# Altium schematic sheet Audio.SchDoc
size A3; SheetNumber: 8; SheetTotal: 9
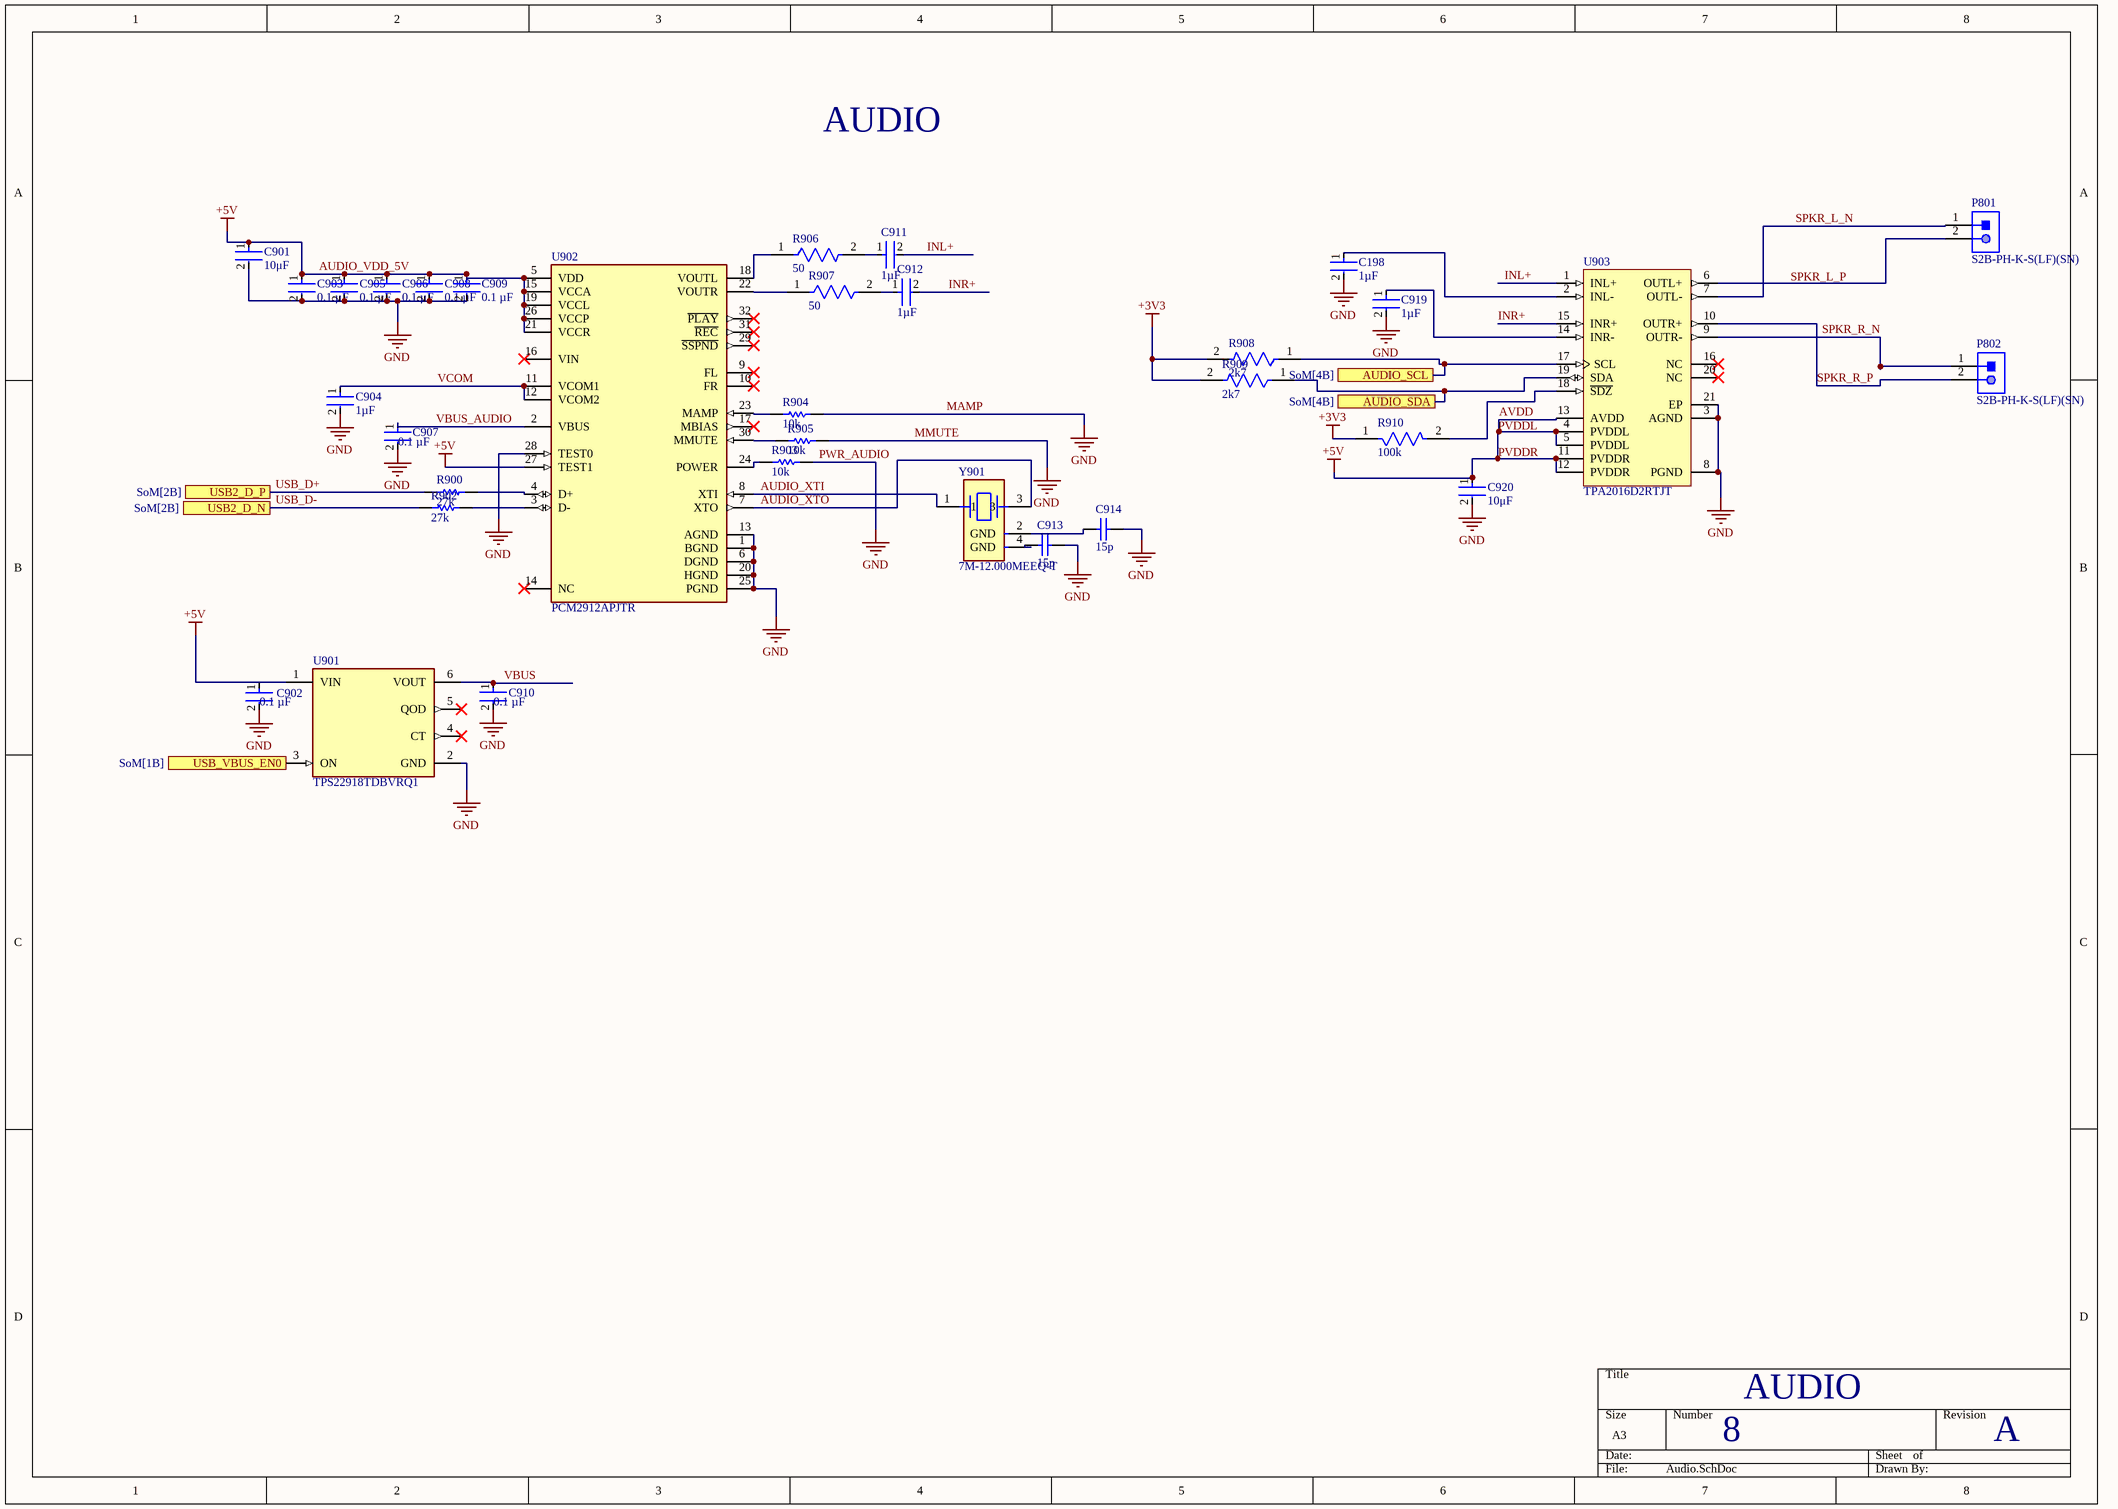
[diagram p0: Audio.SchDoc]

## Parts
C198  1µF  [FP-GRM15-0_1-MFG]
C901  10μF  [FP-GRM31C-0_2-e0_3_0_8-MFG]
C902  0.1 µF  [FP-GRM155-0_05-IPC_B]
C903  0.1 µF  [FP-GRM155-0_05-IPC_B]
C904  1µF  [FP-GRM15-0_1-MFG]
C905  0.1 µF  [FP-GRM155-0_05-IPC_B]
C906  0.1 µF  [FP-GRM155-0_05-IPC_B]
C907  0.1 µF  [FP-GRM155-0_05-IPC_B]
C908  0.1 µF  [FP-GRM155-0_05-IPC_B]
C909  0.1 µF  [FP-GRM155-0_05-IPC_B]
C910  0.1 µF  [FP-GRM155-0_05-IPC_B]
C911  1µF  [FP-GRM15-0_1-MFG]
C912  1µF  [FP-GRM15-0_1-MFG]
C913  15p  [CAPC1005X55X25LL05T10]
C914  15p  [CAPC1005X55X25LL05T10]
C919  1µF  [FP-GRM15-0_1-MFG]
C920  10μF  [FP-GRM31C-0_2-e0_3_0_8-MFG]
P801  S2B-PH-K-S(LF)(SN)  [JST-S2B-PH-K-S_V]
P802  S2B-PH-K-S(LF)(SN)  [JST-S2B-PH-K-S_V]
R900  27k  [RESC1005X40X25LL05T10]
R902  27k  [RESC1005X40X25LL05T10]
R903  10k  [RESC1005X40X25LL05T10]
R904  10k  [RESC1005X40X25LL05T10]
R905  10k  [RESC1005X40X25LL05T10]
R906  50  [FP-CRCW0603-e3-MFG]
R907  50  [FP-CRCW0603-e3-MFG]
R908  2k7  [FP-CR0402-IPC_B]
R909  2k7  [FP-CR0402-IPC_B]
R910  100k  [FP-RC0402-0_4-IPC_A]
U901  TPS22918TDBVRQ1  [FP-DBV0006A-IPC_C]
U902  PCM2912APJTR  [FP-PJT0032A-IPC_C]
U903  TPA2016D2RTJT  [RTJ0020D_V]
Y901  7M-12.000MEEQ-T  [FP-7M-MFG]

## Ports
AUDIO_SCL (see SoM[4B]), AUDIO_SDA (see SoM[4B]), USB2_D_N (see SoM[2B]), USB2_D_P (see SoM[2B]), USB_VBUS_EN0 (see SoM[1B])

## Nets
+3V3: R908.2 R909.2 R910.1
AUDIO_VDD_5V: C901.1 C903.1 C905.1 C906.1 C908.1 C909.1 C920.1 U901.1(VIN) U902.5(VDD) U902.15(VCCA) U902.19(VCCL) U902.21(VCCR) U902.26(VCCP) U902.27(TEST1) U903.4(PVDDL) U903.5(PVDDL) U903.11(PVDDR) U903.12(PVDDR) U903.13(AVDD)  [also labelled +5V, AVDD, PVDDL, PVDDR]
MAMP: C198.2 C901.2 C902.2 C903.2 C904.2 C905.2 C906.2 C907.2 C908.2 C909.2 C910.2 C913.1 C914.1 C919.2 C920.2 R903.1 R904.1 R905.1 U901.2(GND) U902.1(BGND) U902.6(DGND) U902.13(AGND) U902.20(HGND) U902.25(PGND) U902.28(TEST0) U903.3(AGND) U903.8(PGND) U903.21(EP)  [also labelled GND, MMUTE, PWR_AUDIO]
AUDIO_SCL: R908.1 U903.17(SCL) ; port AUDIO_SCL
AUDIO_SDA: R909.1 U903.19(SDA) ; port AUDIO_SDA
AUDIO_XTI: U902.8(XTI) Y901.1
AUDIO_XTO: U902.7(XTO) Y901.3
INL+: C911.2 U903.1(INL+)
INR+: C912.2 U903.15(INR+)
SPKR_L_N: P801.1 U903.7(OUTL-)
SPKR_R_N: P802.1 U903.9(OUTR-)
SPKR_R_P: P802.2 U903.10(OUTR+)
USB_D+: R900.1 ; port USB2_D_P
USB_D-: R902.1 ; port USB2_D_N
USB_VBUS_EN0: U901.3(ON) ; port USB_VBUS_EN0
VBUS: C910.1 U901.6(VOUT)
VBUS_AUDIO: C907.1 U902.2(VBUS)
VCOM: C904.1 U902.11(VCOM1) U902.12(VCOM2)
NetC198_1: C198.1 U903.2(INL-)
NetC911_1: C911.1 R906.2
NetC912_1: C912.1 R907.2
NetC913_2: C913.2 Y901.4(GND)
NetC914_2: C914.2 Y901.2(GND)
NetC919_1: C919.1 U903.14(INR-)
NetP801_2: P801.2 U903.6(OUTL+)
NetR900_2: R900.2 U902.4(D+)
NetR902_2: R902.2 U902.3(D-)
NetR903_2: R903.2 U902.24(POWER)
NetR904_2: R904.2 U902.23(MAMP)
NetR905_2: R905.2 U902.30(MMUTE)
NetR906_1: R906.1 U902.18(VOUTL)
NetR907_1: R907.1 U902.22(VOUTR)
NetR910_2: R910.2 U903.18(~{SDZ})

Not connected (* = marked no-connect by the designer): C902 1; U901 4(CT)* 5(QOD)*; U902 9(FL)* 10(FR)* 14(NC)* 16(VIN)* 17(MBIAS)* 29(~{SSPND})* 31(~{REC})* 32(~{PLAY})*; U903 16(NC)* 20(NC)*

## Notes on the sheet
- AUDIO
- 8
- A
- Labels drawn without touching a wire or pin: SPKR_L_P

## Library data of the parts
C198 C904 C911 C912 C919 = CMP-2008-04556-2: CAP CER 1UF 10V X5R 0402; Manufacturer Part Number: GRM155R61A105KE15D; Manufacturer: Murata; Material: Ceramic; Tolerance: 10%; Temperature Coefficient: 15%; Octopart: https://octopart.com/grm155r61a105ke15d-murata-197442; Lead Free: Yes; ComponentLink2Description: Datasheet; Temperature: -55°C to +85°C; Temperature Range High: +85°C; Height: 0.55mm; Capacitance: 1uF; Ipc Land Pattern Name: CAPC10050X50; ComponentLink2URL: https://search.murata.co.jp/Ceramy/image/img/A01X/G101/ENG/GRM155R61A105KE15-01A.pdf; Temperature Range Low: -55°C; Device Class L2: Capacitors; Voltage Rating: 10V; RoHS: TRUE; Device Class L1: Passive Components; Device Class L3: Ceramic Capacitors; Temperature Characteristic: X5R; Mouser Description: 0402 1 uF 10 V ±10% Tolerance X5R Surface Mount Multilayer Ceramic Capacitor; Automotive: No; Package: GRM15-0.1; Digikey Description: CAP CER 1UF 10V X5R 0402; Value: 1uF; Category: Cap
C901 C920 = CMP-06035-005515-1: Chip Multilayer Ceramic Capacitors for General Purpose, 1206, 10uF, X7R, 15%, 10%, 25V; Dielectric: X7R; Max Operating Temperature: 125°C; Capacitance: 10uF; Voltage Rating (DC): 25V; Case/Package: 1206; Thickness: 0.071inch; Tolerance: 10%; Voltage Rating: 25V; Mount: Surface Mount; Width: 0.063inch; Length: 0.126inch; Min Operating Temperature: -55°C; Packaging: Tape and Reel; Lead Free: Lead Free; Voltage: 25V
C902 C903 C905-C910 = CMP-06035-003750-1: Chip Multilayer Ceramic Capacitors for General Purpose, 0402, 0.10uF, X7R, 15%, 10%, 50V; Capacitance: 100nF; Weight: 0.000212oz; Package Quantity: 50000; Resistor Type: Ceramic; Mount: Surface Mount; Width: 0.5mm; Case Code (Imperial): 0402; Termination: SMD/SMT; Case/Package: 0402; Voltage Rating: 50V; Height: 0.5mm; Length: 0.039inch; Dielectric: X7R; Case Code (Metric): 1005; Min Operating Temperature: -55°C; Thickness: 0.022inch; Tolerance: 10%; Lead Free: Lead Free; Packaging: Tape and Reel; Max Operating Temperature: 125°C; Voltage Rating (DC): 50V
C913 C914 = CMP-2008-04266-1: Manufacturer: Murata; Part Number: GRM1555C1H150JA01D
P801 P802 = CMP-1755-00004-1: Male Header, Pitch 2 mm, 1 x 2 Position, Height 4.8 mm, Tail Length 3.4 mm, -25 to 85 degC, RoHS, Bulk; Case\Package: Radial; Tolerance: 20%; Capacitance: 10 uF; Voltage Rating (DC): 50 V; Packaging: Bulk; ComponentLink1URL: http://www.jst-mfg.com/product/pdf/eng/ePH.pdf; Radiation Hardening: No; Height: 11 mm; Package Quantity: 200; PackageDescription: Male Header, Pitch 2 mm, 1 x 2 Position, Height 4.8 mm, Tail Length 3.4 mm; PackageReference: S2B-PH-K-S; Diameter: 5 mm; Pins: 2; Mount: Through Hole; Max Operating Temperature: 85 degC; Min Operating Temperature: -40 degC; ComponentLink1Description: Datasheet; DatasheetVersion: Dec-12; Length: 11 mm; Lead Pitch: 2 mm; REACH SVHC: No SVHC; Voltage Rating: 50 V; RoHSCompliant: true
R900 R902 = CMP-2002-07055-1: Part Number: RC0402FR-0727RL; Manufacturer: Yageo / Phycomp
R903-R905 = CMP-2002-07353-1: Part Number: RC0402FR-0710KL; Manufacturer: Yageo / Phycomp
R906 R907 = CMP-2000-03436-2: RES Thick Film, 50Ω, 1%, 0.1W, 100ppm/°C, 0603; Voltage Rating (DC): 75V; Resistance: 50R; Power Rating: 100mW; Case/Package: 0603; Packaging: Tape and Reel; Military Standard: Not; REACH SVHC: No SVHC; Width: 0.85mm; Max Operating Temperature: 155°C; Case Code (Metric): 1608; Temperature Coefficient: 100ppm/°C; Lead Free: Lead Free; Height: 0.45mm; Composition: Thick Film; Termination: SMD/SMT; Contact Plating: Tin; Number of Pins: 2; Tolerance: 1%; Depth: 0.85mm; Weight: 7.1E-05oz; Min Operating Temperature: -55°C; Length: 1.55mm; Radiation Hardening: No; Voltage Rating: 75V; Case Code (Imperial): 0603; Package Quantity: 5000; Mount: Surface Mount
R908 R909 = CMP-2002-05009-2: Thick Film Chip Resistors 0402 2.7kΩ 0.0625W 1% 100ppm/°C; Max Power Dissipation: 63mW; Resistance: 2.7kR; Power Rating: 62.5mW; Voltage Rating: 50V; Tolerance: 1%; Max Operating Temperature: 125°C; Mount: Surface Mount; Case Code (Imperial): 0402; Package Quantity: 10000; Composition: Thick Film; Depth: 0.5mm; Thickness: 356um; Case/Package: 0402; Min Operating Temperature: -55°C; Case Code (Metric): 1005; Contact Plating: Tin; Width: 0.02inch; Packaging: Tape and Reel; Height: 0.016inch; Number of Terminations: 2; Length: 1mm; Temperature Coefficient: 100ppm/°C; Termination: SMD/SMT; Radiation Hardening: No; Military Standard: Not
R910 = CMP-2002-07913-2: RES 100K OHM 5% 1/16W 0402; Temperature Coefficient: 100ppm/°C; Max Power Dissipation: 63mW; Resistance: 100kR; Voltage Rating: 50V; Tolerance: 5%; Packaging: Tape and Reel; Termination: SMD/SMT; Case Code (Metric): 1005; Length: 1mm; Power Rating: 63mW; Min Operating Temperature: -55°C; Case/Package: 0402; Construction: Rectangular; Series: RC; Resistance Tolerance: 5%; Height: 0.016inch; Case Code (Imperial): 0402; RoHS Compliant: Yes; Size Code: 0402; Number of Terminations: 2; Features: Moisture Resistant; Width: 0.02inch; Max Operating Temperature: 155°C; Military Standard: Not; Lead Free: Lead Free; Depth: 0.5mm; Package Quantity: 1; Resistor Type: Thick Film
U901 = CMP-04910-000092-1: IC PWR SWITCH N-CHAN 1:1 SOT23-6; Interface: On/Off; Number of Channels: 1; Output Configuration: High Side; Max Output Current: 2A; Case/Package: SOT-23-6; Max Operating Temperature: 105°C; Packaging: Tape and Reel; Lead Free: Lead Free; Number of Outputs: 1; Min Operating Temperature: -40°C; RoHS Compliant: Yes
U902 = CMP-04873-000003-1: IC STEREO AUD CODEC W/USB 32TQFP; Interface: USB; Number of D/A Converters: 1; Min Supply Voltage: 3V; Max Supply Voltage: 5.25V; Operating Supply Voltage: 5V; Signal to Noise Ratio (SNR): 92dB; Number of Analog Outputs: 2; Sampling Rate: 48KS/s; Resolution: 16b; Package Quantity: 1000; Max Operating Temperature: 85°C; Series: -; Radiation Hardening: No; Number of Analog Inputs: 1; Packaging: Tape and Reel; Number of ADC Channels: 1; Mount: Surface Mount; Number of Pins: 32; Lead Free: Lead Free; RoHS Compliant: Yes; Number of A/D Converters: 1; Contact Plating: Gold; Min Operating Temperature: -25°C; Case/Package: TQFP; Type: General Purpose; Number of DAC Channels: 2
U903 = CMP-0991-00197-2: 2.8-W/Ch Stereo Class-D Audio Amplifier with SmartGainTM AGC / DRC, -40 to 85 degC, 20-pin QFN (RTJ20), Green (RoHS & no Sb/Br); Manufacturer: Texas Instruments; Supply Max(Max)(Volt): 5.5; Supply Min(Min)(Volt): 2.5; SubFamily: Dynamic Speaker; Output Power(W): 2.8; PSRR(dB): -80; Speaker Channels: Stereo; Special Features: AGC/DRC; Mounting Technology: Surface Mount; PartNumber: TPA2016D2RTJT; ComponentLink3Description: Package Specification; Speaker Amp Type: Class-D; ComponentLink1Description: Manufacturer URL; ComponentLink2Description: Datasheet; Eco-Plan: Green (RoHS & no Sb/Br); DatasheetVersion: SLOS524D; PackageReference: RTJ0020D; PackageDescription: 20-pin Plastic Flat Pack, Body 4 x 4 mm, Pitch 0.5 mm; ComponentLink1URL: http://www.ti.com/; ComponentLink3URL: http://www.ti.com/litv/pdf/mpqf156e; ComponentLink2URL: http://www.ti.com/general/docs/lit/getliterature.tsp?genericPartNumber=TPA2016D2&fileType=pdf; PackageVersion: 4205505/F, 07/2011
Y901 = CMP-18717-000311-1: Crystal 12MHz, 10ppm, 10pF, 80Ω; ESR (Equivalent Series Resistance): 100R; Width: 0.098inch; Number of Pins: 4; Case/Package: SMD/SMT; REACH SVHC: No SVHC; Frequency: 12MHz; Mount: Surface Mount; Frequency Stability: 10ppm; Load Capacitance: 10pF; Max Operating Temperature: 70°C; RoHS Compliant: Yes; Depth: 2.5mm; Length: 3.2mm; Termination: SMD/SMT; Frequency Tolerance: 10ppm; Min Operating Temperature: -20°C; Series: 7M; Packaging: Tape and Reel; Tolerance: 10ppm; Height: 0.031inch; Package Quantity: 3000